# Altium schematic sheet MOT_DRV.SchDoc: MOT_DRV_PINOUT
size A; DrawnBy: Ahmad Banshee
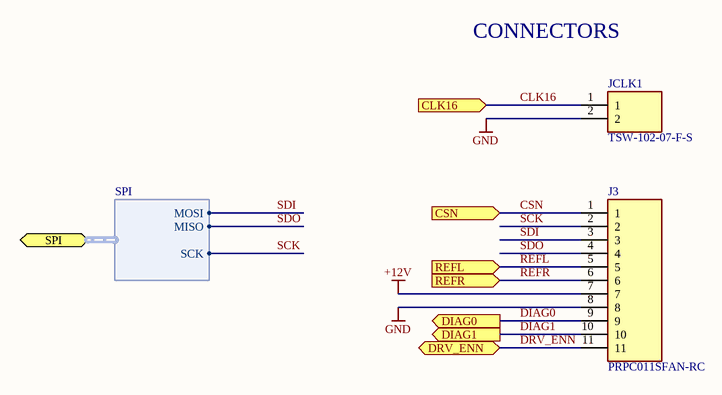
[diagram p0: MOT_DRV.SchDoc]

## Parts
J3  PRPC011SFAN-RC  [HDRV11W64P254_1X11_2794X254X1058P]
JCLK1  TSW-102-07-F-S  [HDRV2W64P254_1X2_508X241X838P]

## Ports
CLK16 (in), CSN (in), DIAG0 (out), DIAG1 (out), DRV_ENN, REFL (in), REFR (in), SPI (harness SPI)

## Harnesses
SPI: MOSI, MISO, SCK

## Nets
+12V: J3.7
GND: J3.8 JCLK1.2
CLK16: JCLK1.1 ; port CLK16
CSN: J3.1 ; port CSN
DIAG0: J3.9 ; port DIAG0
DIAG1: J3.10 ; port DIAG1
DRV_ENN: J3.11 ; port DRV_ENN
REFL: J3.5 ; port REFL
REFR: J3.6 ; port REFR
SCK: J3.2 ; port SPI.SCK
SDI: J3.3 ; port SPI.MOSI
SDO: J3.4 ; port SPI.MISO

## Notes on the sheet
- CONNECTORS

## Library data of the parts
J3 = PRPC011SFAN-RC: Connector; Manufacturer_Name: Sullins; Datasheet Link: https://media.digikey.com/PDF/Data%20Sheets/Sullins%20PDFs/xRxCzzzSxxN-RC_ST_11635-B.pdf; Height: 10.58mm; Manufacturer_Part_Number: PRPC011SFAN-RC
JCLK1 = TSW-102-07-F-S: Connector; Manufacturer_Name: SAMTEC; Datasheet Link: http://suddendocs.samtec.com/catalog_english/tsw_th.pdf; Height: 8.38mm; Manufacturer_Part_Number: TSW-102-07-F-S; Mouser Part Number: 200-TSW10207FS; Mouser Price/Stock: https://www.mouser.com/Search/Refine.aspx?Keyword=200-TSW10207FS; RS Part Number: 1557967; RS Price/Stock: http://uk.rs-online.com/web/p/products/1557967